# Altium schematic sheet 15 PM8916_CHARGING GPIO.SchDoc
size 871 x 576 mm
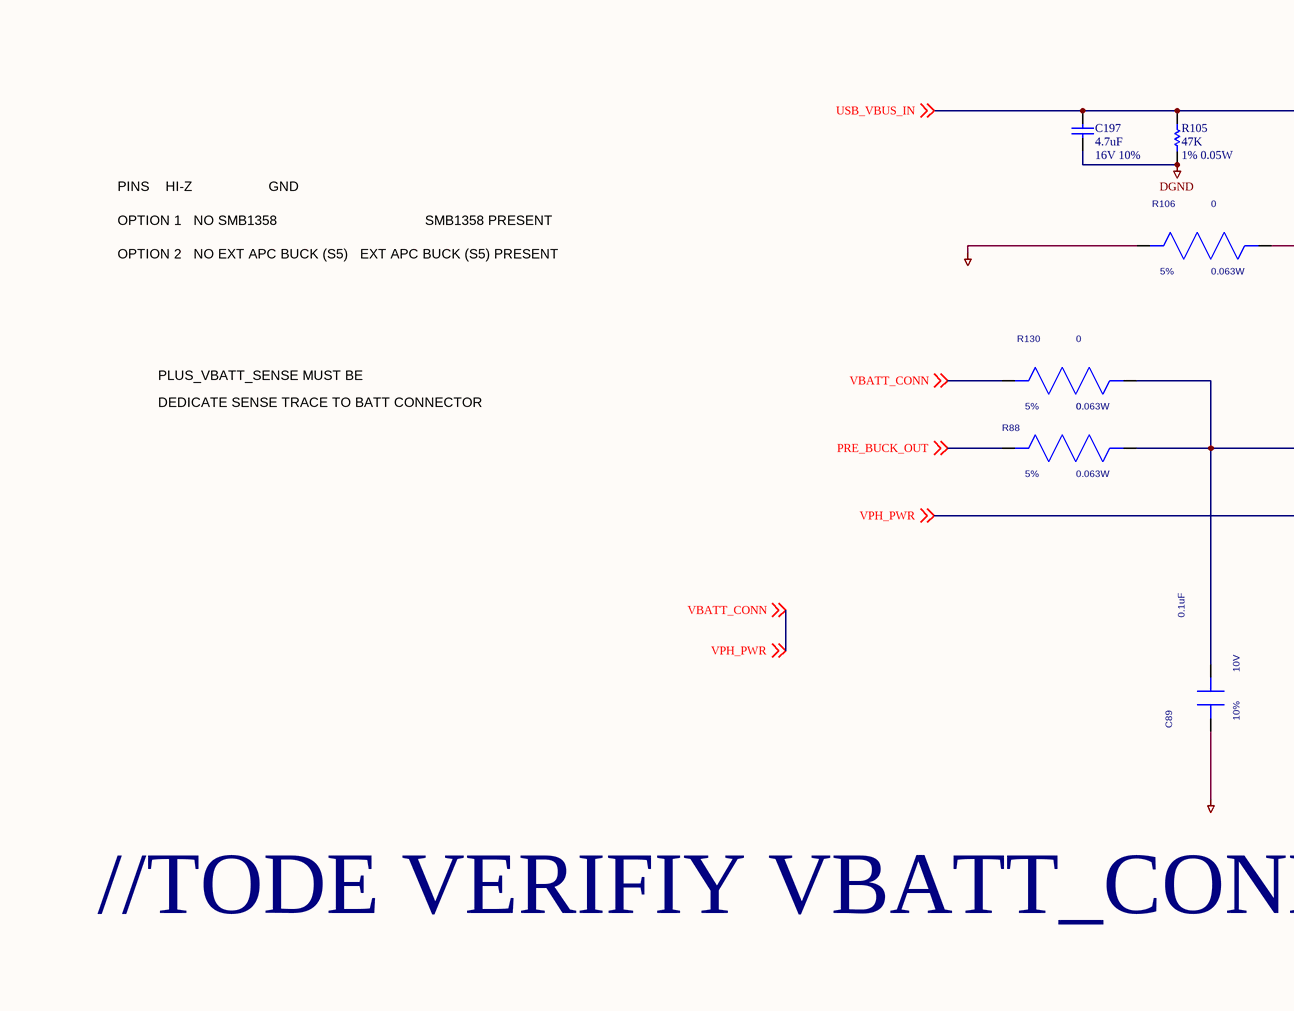
[diagram p0: 15 PM8916_CHARGING GPIO.SchDoc, top left]
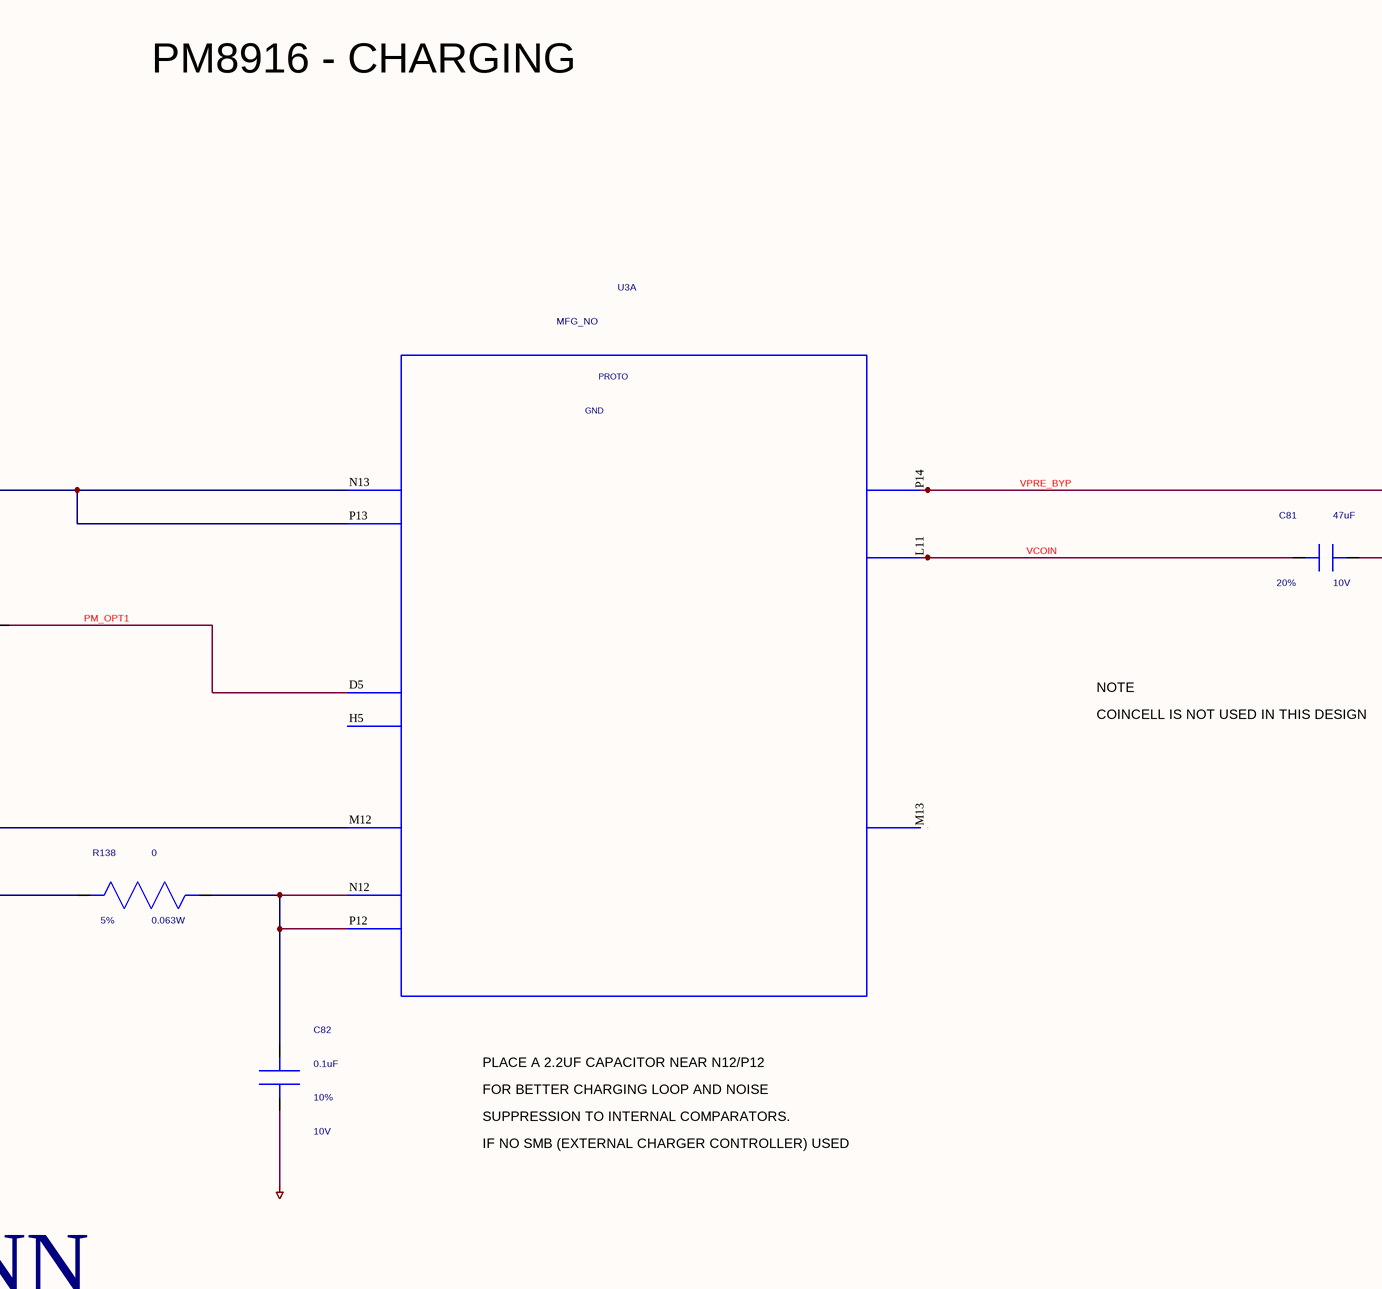
[diagram p1: 15 PM8916_CHARGING GPIO.SchDoc, top middle]
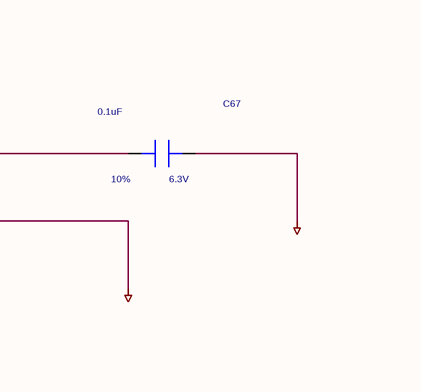
[diagram p2: 15 PM8916_CHARGING GPIO.SchDoc, top right]
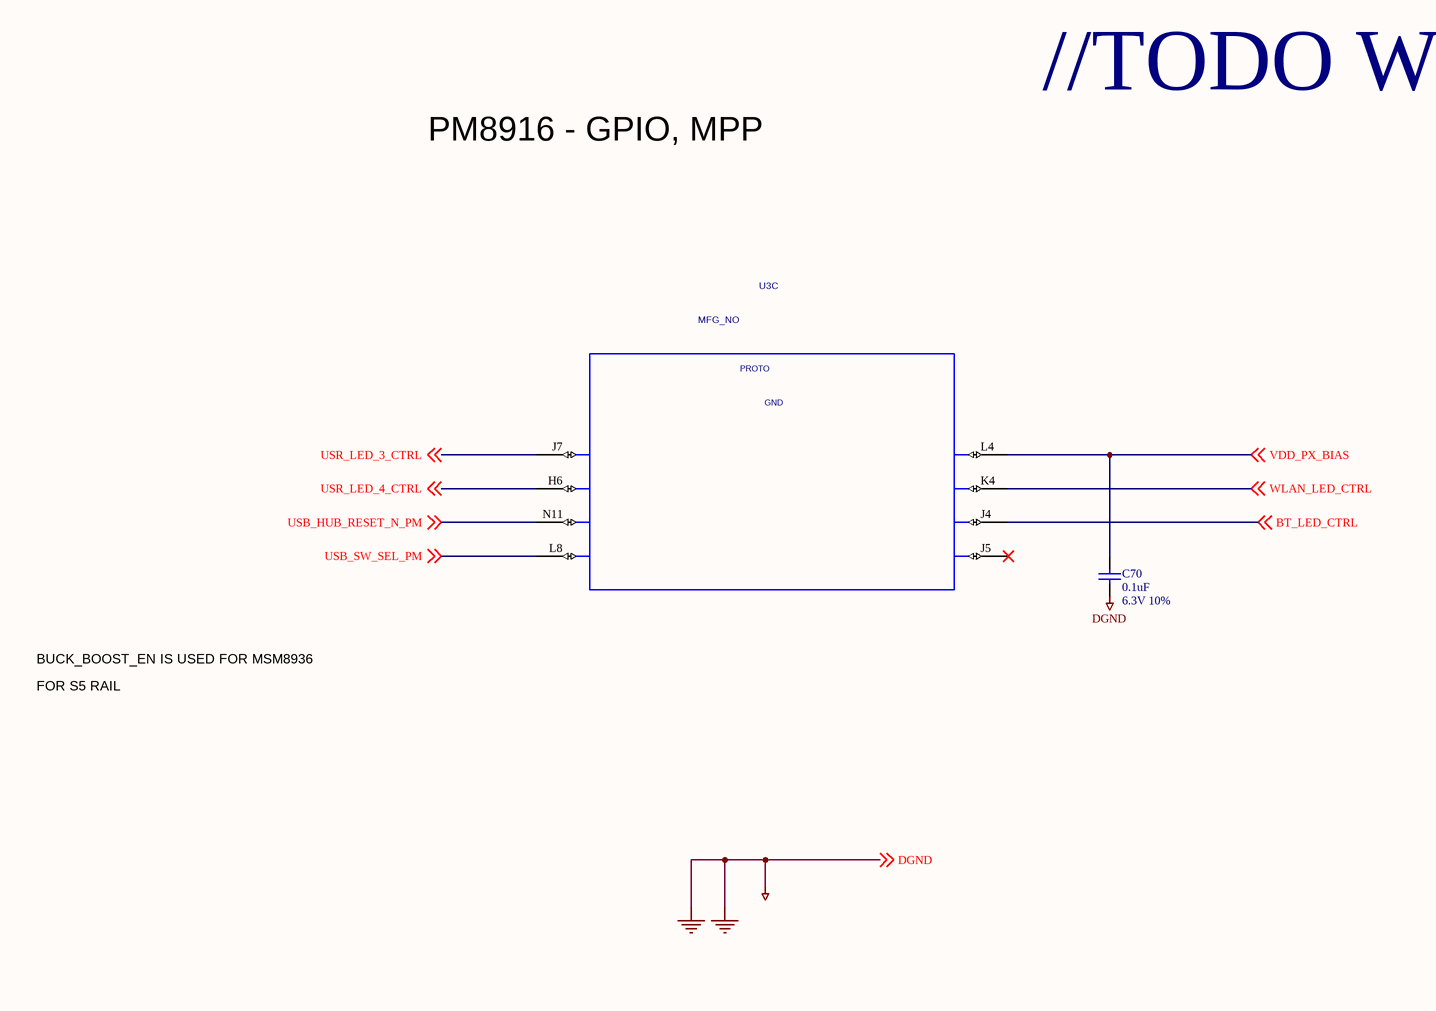
[diagram p3: 15 PM8916_CHARGING GPIO.SchDoc, bottom left]
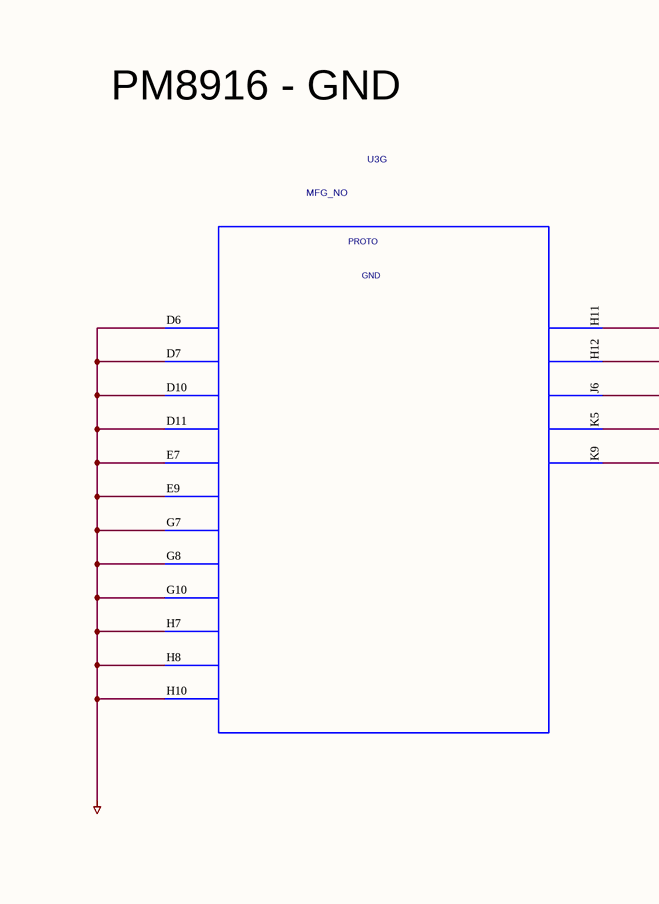
[diagram p4: 15 PM8916_CHARGING GPIO.SchDoc, bottom middle]
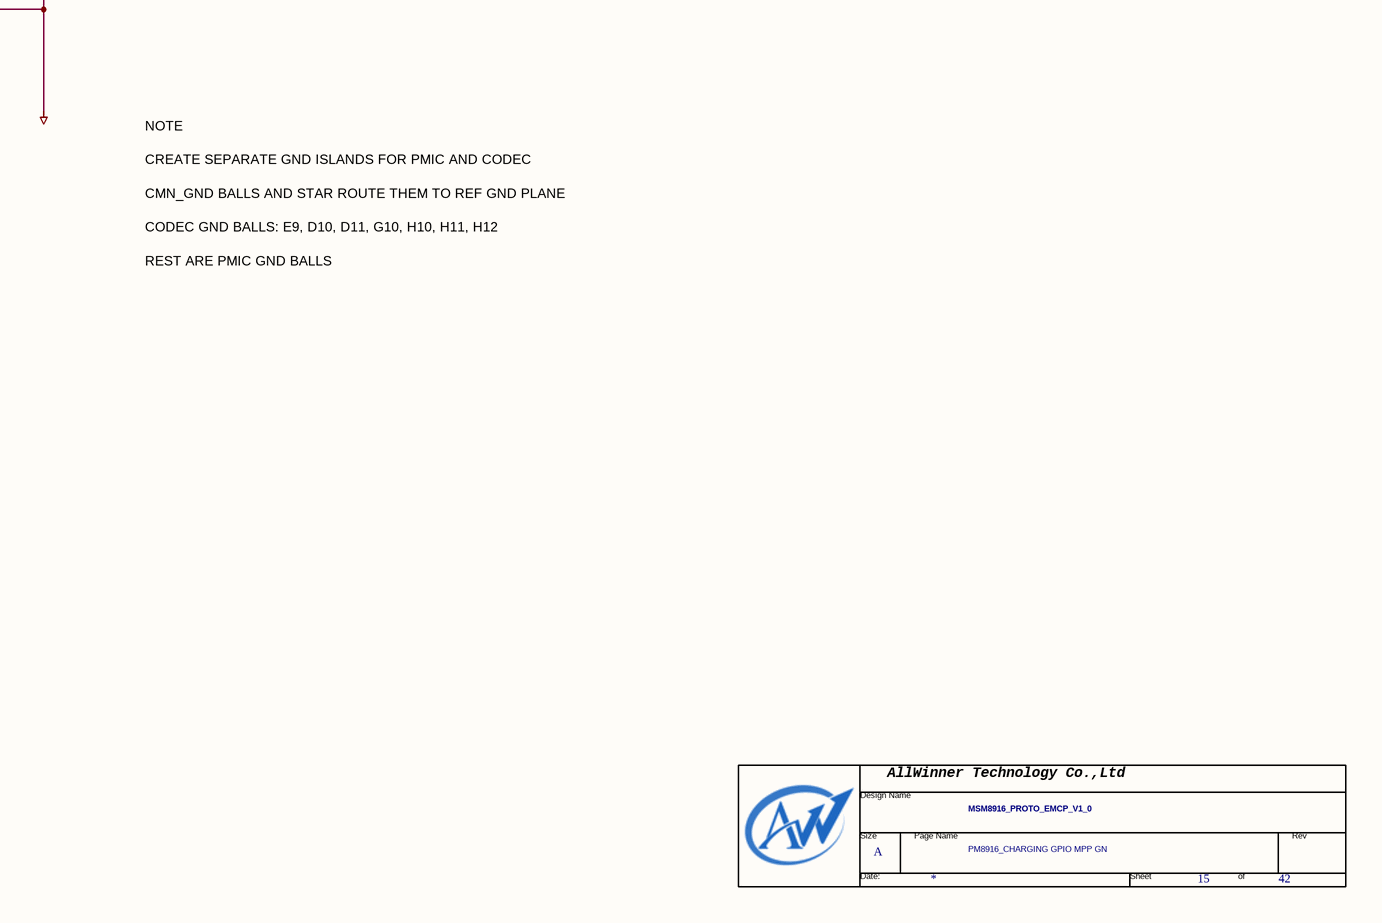
[diagram p5: 15 PM8916_CHARGING GPIO.SchDoc, bottom right]

## Parts
*  Page Count: 42  Page Number: 15  Page Size: A  Title: MSM8916_PROTO_EMCP_V1_0  Doc: PM8916_CHARGING GPIO MPP GN  (hidden comment: TitleBlock0-AW)  (graphical)
C67  0.1uF  VOLT: 10%  Tolerance: 6.3V
C70  0.1uF  value 6.3V 10%  [RAD-0.3]
C81  47uF  VOLT: 10V  Tolerance: 20%
C82  0.1uF  VOLT: 10V  Tolerance: 10%
C89  0.1uF  VOLT: 10V  Tolerance: 10%
C197  4.7uF  value 16V 10%  [RAD-0.3]
R88  0  Tolerance: 5%  POWER: 0.063W
R105  47K  value 1% 0.05W  [AXIAL-0.3]
R106  0  Tolerance: 5%  POWER: 0.063W
R130  0  Tolerance: 5%  POWER: 0.063W
R138  0  Tolerance: 5%  POWER: 0.063W
U3  SYMNAME: GND  PART_ID: MFG_NO  BLOCKID: PROTO  [PM-8916-0-176NSP-TR-00-0]  (hidden comment: ASIC_PM8916)  (parts A,C,G of 7)

## Nets
DGND: C67.1(POS) C70.1 C81.2(NEG) C82.2(NEG) C89.1(POS) C197.1 R105.1 R106.1(POS) U3.D6(CMN_GND_1) U3.D7(CMN_GND_2) U3.D10(CMN_GND_3) U3.D11(CMN_GND_4) U3.E7(CMN_GND_5) U3.E9(CMN_GND_6) U3.G7(CMN_GND_7) U3.G8(CMN_GND_8) U3.G10(CMN_GND_9) U3.H7(CMN_GND_10) U3.H8(CMN_GND_11) U3.H10(CMN_GND_12) U3.H11(CMN_GND_13) U3.H12(CMN_GND_14) U3.J6(CMN_GND_15) U3.K5(CMN_GND_16) U3.K9(CMN_GND_17) ; off-sheet DGND  [also labelled GND]
BT_LED_CTRL: U3.J4(MPP3) ; off-sheet BT_LED_CTRL
PM_OPT1: R106.2(NEG) U3.D5(OPTION1)
PRE_BUCK_OUT: R88.1(POS) ; off-sheet PRE_BUCK_OUT
USB_HUB_RESET_N_PM: U3.N11(GPIO3) ; off-sheet USB_HUB_RESET_N_PM
USB_SW_SEL_PM: U3.L8(GPIO4) ; off-sheet USB_SW_SEL_PM
USB_VBUS_IN: C197.2 R105.2 U3.N13(USB_IN1) U3.P13(USB_IN2) ; off-sheet USB_VBUS_IN
USR_LED_3_CTRL: U3.J7(GPIO1) ; off-sheet USR_LED_3_CTRL
USR_LED_4_CTRL: U3.H6(GPIO2) ; off-sheet USR_LED_4_CTRL
VBATT_CONN: R130.1(POS) R138.1(POS) ; off-sheet VPH_PWR, off-sheet VBATT_CONN  [also labelled VPH_PWR]
VCOIN: C81.1(POS) U3.L11(VCOIN)
VDD_PX_BIAS: C70.2 U3.L4(MPP1) ; off-sheet VDD_PX_BIAS
VPRE_BYP: C67.2(NEG) U3.P14(VPRE_BYP)
WLAN_LED_CTRL: U3.K4(MPP2) ; off-sheet WLAN_LED_CTRL
NetC82_1: C82.1(POS) R138.2(NEG) U3.N12(VBAT1) U3.P12(VBAT2)
NetC89_2: C89.2(NEG) R88.2(NEG) R130.2(NEG) U3.M12(VBAT_SNS)

Not connected (* = marked no-connect by the designer): U3 H5(OPTION2) J5(MPP4)* M13(CHG_LED_SINK)

## Notes on the sheet
- PM8916 - CHARGING
- PINS    HI-Z                   GND
- OPTION 1   NO SMB1358                                     SMB1358 PRESENT
- OPTION 2   NO EXT APC BUCK (S5)   EXT APC BUCK (S5) PRESENT
- NOTE
- COINCELL IS NOT USED IN THIS DESIGN
- PLUS_VBATT_SENSE MUST BE
- DEDICATE SENSE TRACE TO BATT CONNECTOR
- PLACE A 2.2UF CAPACITOR NEAR N12/P12
- FOR BETTER CHARGING LOOP AND NOISE
- SUPPRESSION TO INTERNAL COMPARATORS.
- IF NO SMB (EXTERNAL CHARGER CONTROLLER) USED
- //TODE VERIFIY VBATT_CONN
- //TODO WLAN LED HERE
- PM8916 - GND
- PM8916 - GPIO, MPP
- CREATE SEPARATE GND ISLANDS FOR PMIC AND CODEC
- BUCK_BOOST_EN IS USED FOR MSM8936
- CMN_GND BALLS AND STAR ROUTE THEM TO REF GND PLANE
- CODEC GND BALLS: E9, D10, D11, G10, H10, H11, H12
- FOR S5 RAIL
- REST ARE PMIC GND BALLS
- (in symbol TitleBlock0-AW) AllWinner Technology Co.,Ltd; Design Name; Size; Page Name; Rev; Date:; Sheet; of

## Library data of the parts
C67 C81 C89 = CAP#1: PART_NUMBER: MCN_NO; PART_ID: MFG_NO; OriginalSymbolOrigin: (-75,50); SYMNAME: CAP; CDS_LMAN_SYM_OUTLINE: -25,50,25,-50; PACK_TYPE: ?
C70 C197 = Cap: Capacitor; Published: 8-Jun-2000; LatestRevisionDate: 17-Jul-2002; LatestRevisionNote: Re-released for DXP Platform.; PackageReference: RAD-0.3; Publisher: Altium Limited; PackageDescription: Radial Cap, Thru-Hole; 2 Leads; 0.3 in Pin Spacing
C82 = CAP: PART_NUMBER: MCN_NO; PART_ID: MFG_NO; OriginalSymbolOrigin: (-100,75); CDS_LMAN_SYM_OUTLINE: -75,25,75,-25; SYMNAME: CAP; PACK_TYPE: ?
R88 R106 R130 R138 = RESISTOR_Dup3: PART_NUMBER: MCN_NO; PART_ID: MFG_NO; OriginalSymbolOrigin: (-200,50); CDS_LMAN_SYM_OUTLINE: -150,50,150,-50; SYMNAME: resistor; PACK_TYPE: ?
R105 = Res1: Resistor; Published: 8-Jun-2000; LatestRevisionDate: 17-Jul-2002; LatestRevisionNote: Re-released for DXP Platform.; PackageReference: AXIAL-0.3; Publisher: Altium Limited; PackageDescription: Axial Device, Thru-Hole; 2 Leads; 0.3 in Pin Spacing
U3 = ASIC_PM8916: PART_NUMBER: MCN_NO; OriginalSymbolOrigin: (-1050,1125); SPLIT_INST: TRUE; CDS_LMAN_SYM_OUTLINE: -850,1125,875,-1250; CDS_LMAN_SPLIT_NUMBER: 1 of 7; PACK_TYPE: ?
* = TitleBlock0-AW: RevCode: ?; Page Create Date: March  8, 1995; Page Modify Date: *